# EasyEDA Pro project ProPrj_Line_Follower_TURBO_v1.2_2026-04-18.epro

# Schematic Schematic _Line_Follower_Turbo_v1.2
Board Name: Board1; Create Date: 2025-11-21; Page Name: P1; Project Name: High-Speed Line Follower Robot – Robotics_Wiz; Schematic Name: Schematic1; Update Date: 2025-11-21; Company: EasyEDA.com; Page Size: A4; Version: V1.0
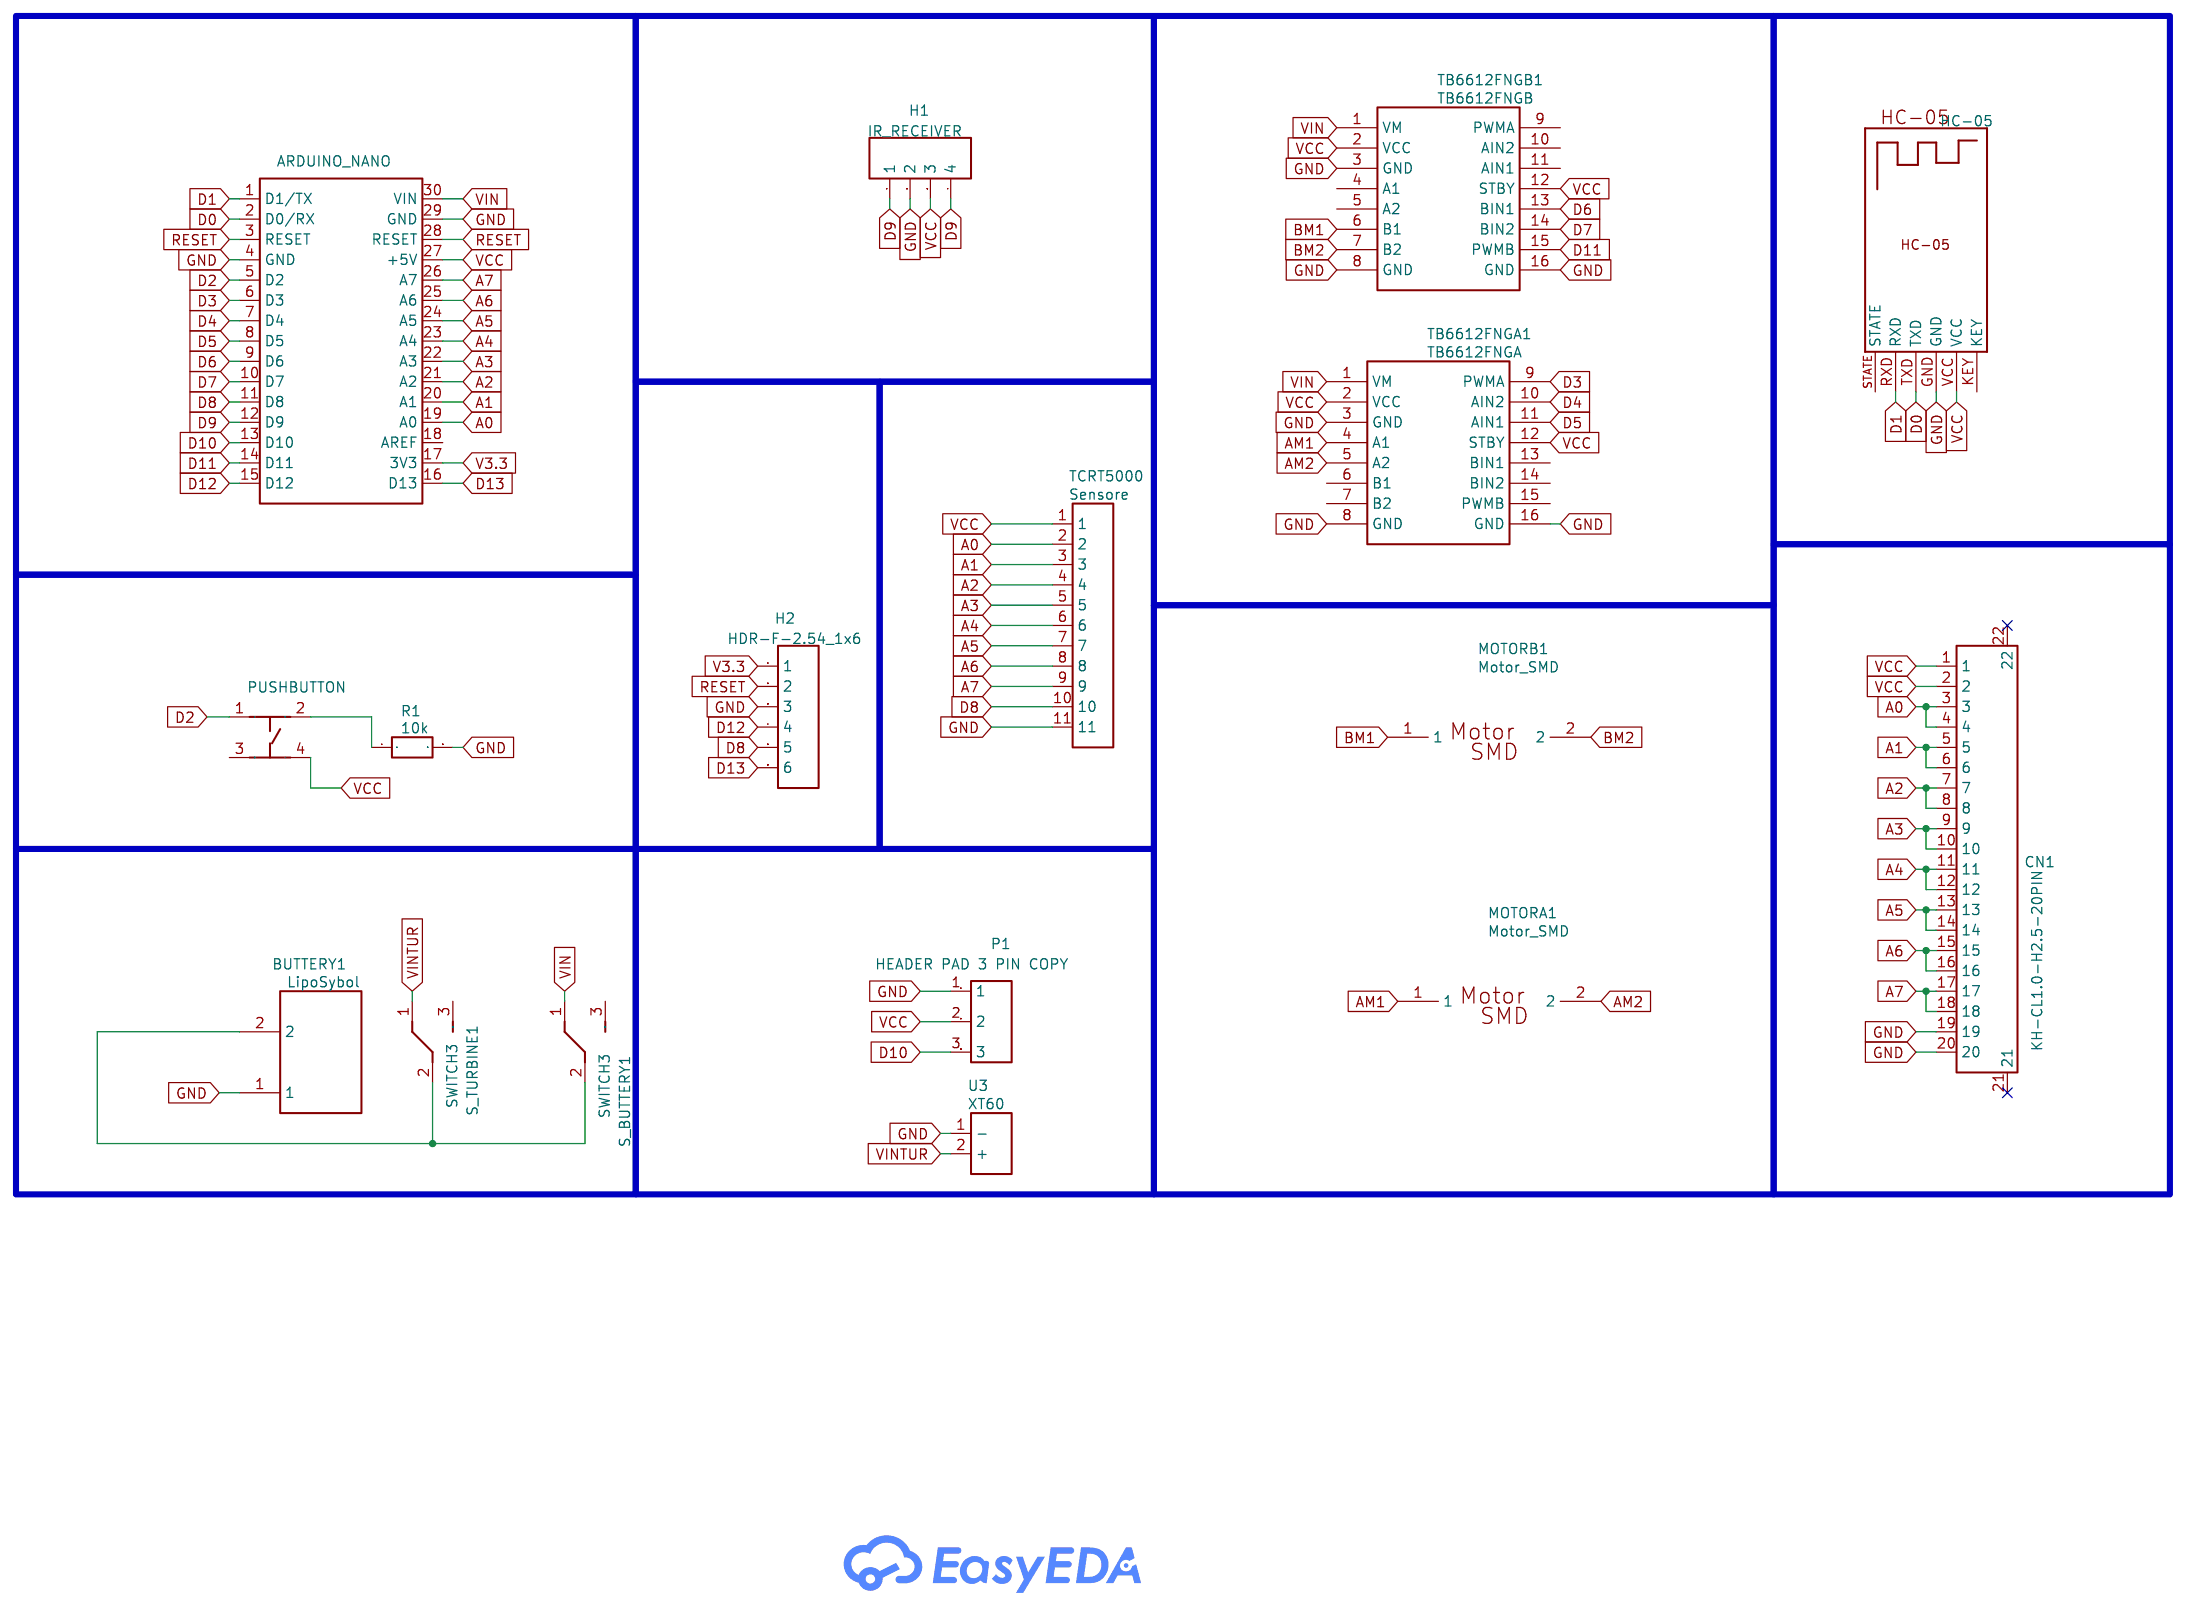
[diagram p0: schematic sheet]

## Parts
1  HC-05  [HC-05]
ARDUINO_NANO1  ARDUINO_NANO  [COMM-TH_ARDUINO_NANO]
BUTTERY1  LipoSybol  [2PIN-RMC]
CN1  KH-CL1.0-H2.5-20PIN  [FPC-SMD_KH-CL1.0-H2.5-20PIN]
D2  PUSHBUTTON  [SW-SMD_4P-L6.0-W6.0-P4.50-LS10.0_TL3301EF160QG]
H1  IR_RECEIVER  [HDR-F-2.54_1X4]
H2  HDR-F-2.54_1x6  [HDR-F-2.54_1X6]
MOTORA1  Motor_SMD  [MOTORSMD]
MOTORB1  Motor_SMD  [MOTORSMD]
P1  HEADER PAD 3 PIN COPY  [CONNECTOR_PINHEADER_2.54MM:PINHEADER_1X3]
R1  10k  [R0603]
S_BUTTERY1  SWITCH3  [SWITCH3PINS-DIP]
S_TURBINE1  SWITCH3  [SWITCH3PINS-DIP]
TB6612FNGA1  TB6612FNGA  [TB6612FNG]
TB6612FNGB1  TB6612FNGB  [TB6612FNG]
TCRT5000  Sensore
U3  XT60  [CONN-TH_XT60]

## Library data of the parts
1 = HC-05: Contributor: cingoz57; spicePre: ?
ARDUINO_NANO1 = ARDUINO_NANO: Supplier: LCSC; Supplier Part: C9900017879; Manufacturer: null; JLCPCB Part Class: Extended Part; link: https://lcsc.com/eda_search?q=C9900017879&%26type=1&ref=editor; Contributor: lcsc; spicePre: U
BUTTERY1 = LipoSybol: Contributor: tech1service; spicePre: U; spiceSymbolName: 2PIN RMC
CN1 = KH-CL1.0-H2.5-20PIN: Supplier: LCSC; Supplier Part: C2797243; Manufacturer: kinghelm(金航标); JLCPCB Part Class: Extended Part; Contributor: LCSC; spicePre: C
D2 = PUSHBUTTON: Supplier: LCSC; Supplier Part: C9900003768; Manufacturer: null; Manufacturer Part: 4pinTACTPCBTHTPushButton; JLCPCB Part Class: Extended Part; Contributor: LCSC; spicePre: K; spiceSymbolName: 4PINTACTPCBTHTPUSHBUTTON
H1 = IR_RECEIVER: Supplier Part: C225501; Supplier: LCSC; Contributor: LCEDA_Lib; spicePre: H; spiceSymbolName: HDR-F-2.54_1x4
H2 = HDR-F-2.54_1x6: Supplier Part: C40877; Supplier: LCSC; Contributor: LCEDA_Lib; spicePre: H
MOTORA1 MOTORB1 = Motor_SMD: Manufacturer Part: RayitoCorp; Supplier: RayitoCorp; Contributor: Josueking23; spicePre: U
P1 = HEADER PAD 3 PIN COPY: Supplier: LCSC; Manufacturer: BOOMELE; Manufacturer Part: Female headerHDR1X8-2.54; Supplier Part: C27438; JLCPCB Part Class: Extended Part; Contributor: juchani; spicePre: P; spiceSymbolName: HEADER PAD 3 PIN
R1 = 10k: nameAlias: Value(Ω); Contributor: LCEDA_Lib; spicePre: R; spiceSymbolName: R_0603_EU
S_BUTTERY1 S_TURBINE1 = SWITCH3: Contributor: TruongKhoa; spicePre: S
TB6612FNGA1 = TB6612FNGA: Contributor: NonpawitE; spicePre: U
TB6612FNGB1 = TB6612FNGB: Contributor: NonpawitE; spicePre: U
TCRT5000 = Sensore: Supplier: LCSC; Supplier Part: C9900004878; Manufacturer: null; Manufacturer Part: HDR-1X11; JLCPCB Part Class: Extended Part; link: https://lcsc.com/eda_search?q=C9900004878&%26type=1&ref=editor; Contributor: LCSC; spicePre: U; spiceSymbolName: HDR-1X11
U3 = XT60: Supplier: LCSC; Supplier Part: C98733; Manufacturer: AMASS(艾迈斯); Manufacturer Part: XT60-M.; JLCPCB Part Class: Extended Part; Contributor: lcsc; spicePre: U

## Nets
GND: 1.GND ARDUINO_NANO1.4(GND) ARDUINO_NANO1.29(GND) BUTTERY1.1 CN1.19 CN1.20 H1.2 H2.3 P1.1 R1.2 TB6612FNGA1.3(GND) TB6612FNGA1.8(GND) TB6612FNGA1.16(GND) TB6612FNGB1.3(GND) TB6612FNGB1.8(GND) TB6612FNGB1.16(GND) TCRT5000.11 U3.1(-)
V3.3: ARDUINO_NANO1.17(3V3) H2.1
VCC: 1.VCC ARDUINO_NANO1.27(+5V) CN1.1 CN1.2 D2.4 H1.3 P1.2 TB6612FNGA1.2(VCC) TB6612FNGA1.12(STBY) TB6612FNGB1.2(VCC) TB6612FNGB1.12(STBY) TCRT5000.1
VIN: ARDUINO_NANO1.30(VIN) S_BUTTERY1.1 TB6612FNGA1.1(VM) TB6612FNGB1.1(VM)
VINTUR: S_TURBINE1.1 U3.2(+)
A0: ARDUINO_NANO1.19(A0) CN1.3 CN1.4 TCRT5000.2
A1: ARDUINO_NANO1.20(A1) CN1.5 CN1.6 TCRT5000.3
A2: ARDUINO_NANO1.21(A2) CN1.7 CN1.8 TCRT5000.4
A3: ARDUINO_NANO1.22(A3) CN1.9 CN1.10 TCRT5000.5
A4: ARDUINO_NANO1.23(A4) CN1.11 CN1.12 TCRT5000.6
A5: ARDUINO_NANO1.24(A5) CN1.13 CN1.14 TCRT5000.7
A6: ARDUINO_NANO1.25(A6) CN1.15 CN1.16 TCRT5000.8
A7: ARDUINO_NANO1.26(A7) CN1.17 CN1.18 TCRT5000.9
AM1: MOTORA1.1 TB6612FNGA1.4(A1)
AM2: MOTORA1.2 TB6612FNGA1.5(A2)
BM1: MOTORB1.1 TB6612FNGB1.6(B1)
BM2: MOTORB1.2 TB6612FNGB1.7(B2)
D0: 1.TXD ARDUINO_NANO1.2(D0/RX)
D1: 1.RXD ARDUINO_NANO1.1(D1/TX)
D2: ARDUINO_NANO1.5(D2) D2.1
D3: ARDUINO_NANO1.6(D3) TB6612FNGA1.9(PWMA)
D4: ARDUINO_NANO1.7(D4) TB6612FNGA1.10(AIN2)
D5: ARDUINO_NANO1.8(D5) TB6612FNGA1.11(AIN1)
D6: ARDUINO_NANO1.9(D6) TB6612FNGB1.13(BIN1)
D7: ARDUINO_NANO1.10(D7) TB6612FNGB1.14(BIN2)
D8: ARDUINO_NANO1.11(D8) H2.5 TCRT5000.10
D9: ARDUINO_NANO1.12(D9) H1.1 H1.4
D10: ARDUINO_NANO1.13(D10) P1.3
D11: ARDUINO_NANO1.14(D11) TB6612FNGB1.15(PWMB)
D12: ARDUINO_NANO1.15(D12) H2.4
D13: ARDUINO_NANO1.16(D13) H2.6
RESET: ARDUINO_NANO1.3(RESET) ARDUINO_NANO1.28(RESET) H2.2
BUTTERY1_2: BUTTERY1.2 S_BUTTERY1.2 S_TURBINE1.2
R1_1: D2.2 R1.1

Not connected (* = marked no-connect by the designer): 1 KEY STATE; ARDUINO_NANO1 18(AREF); CN1 21* 22*; D2 3; S_BUTTERY1 3(I/O2); S_TURBINE1 3(I/O2); TB6612FNGA1 6(B1) 7(B2) 13(BIN1) 14(BIN2) 15(PWMB); TB6612FNGB1 4(A1) 5(A2) 9(PWMA) 10(AIN2) 11(AIN1)

# Board PCB_Line_Follower_Turbo_v1.2
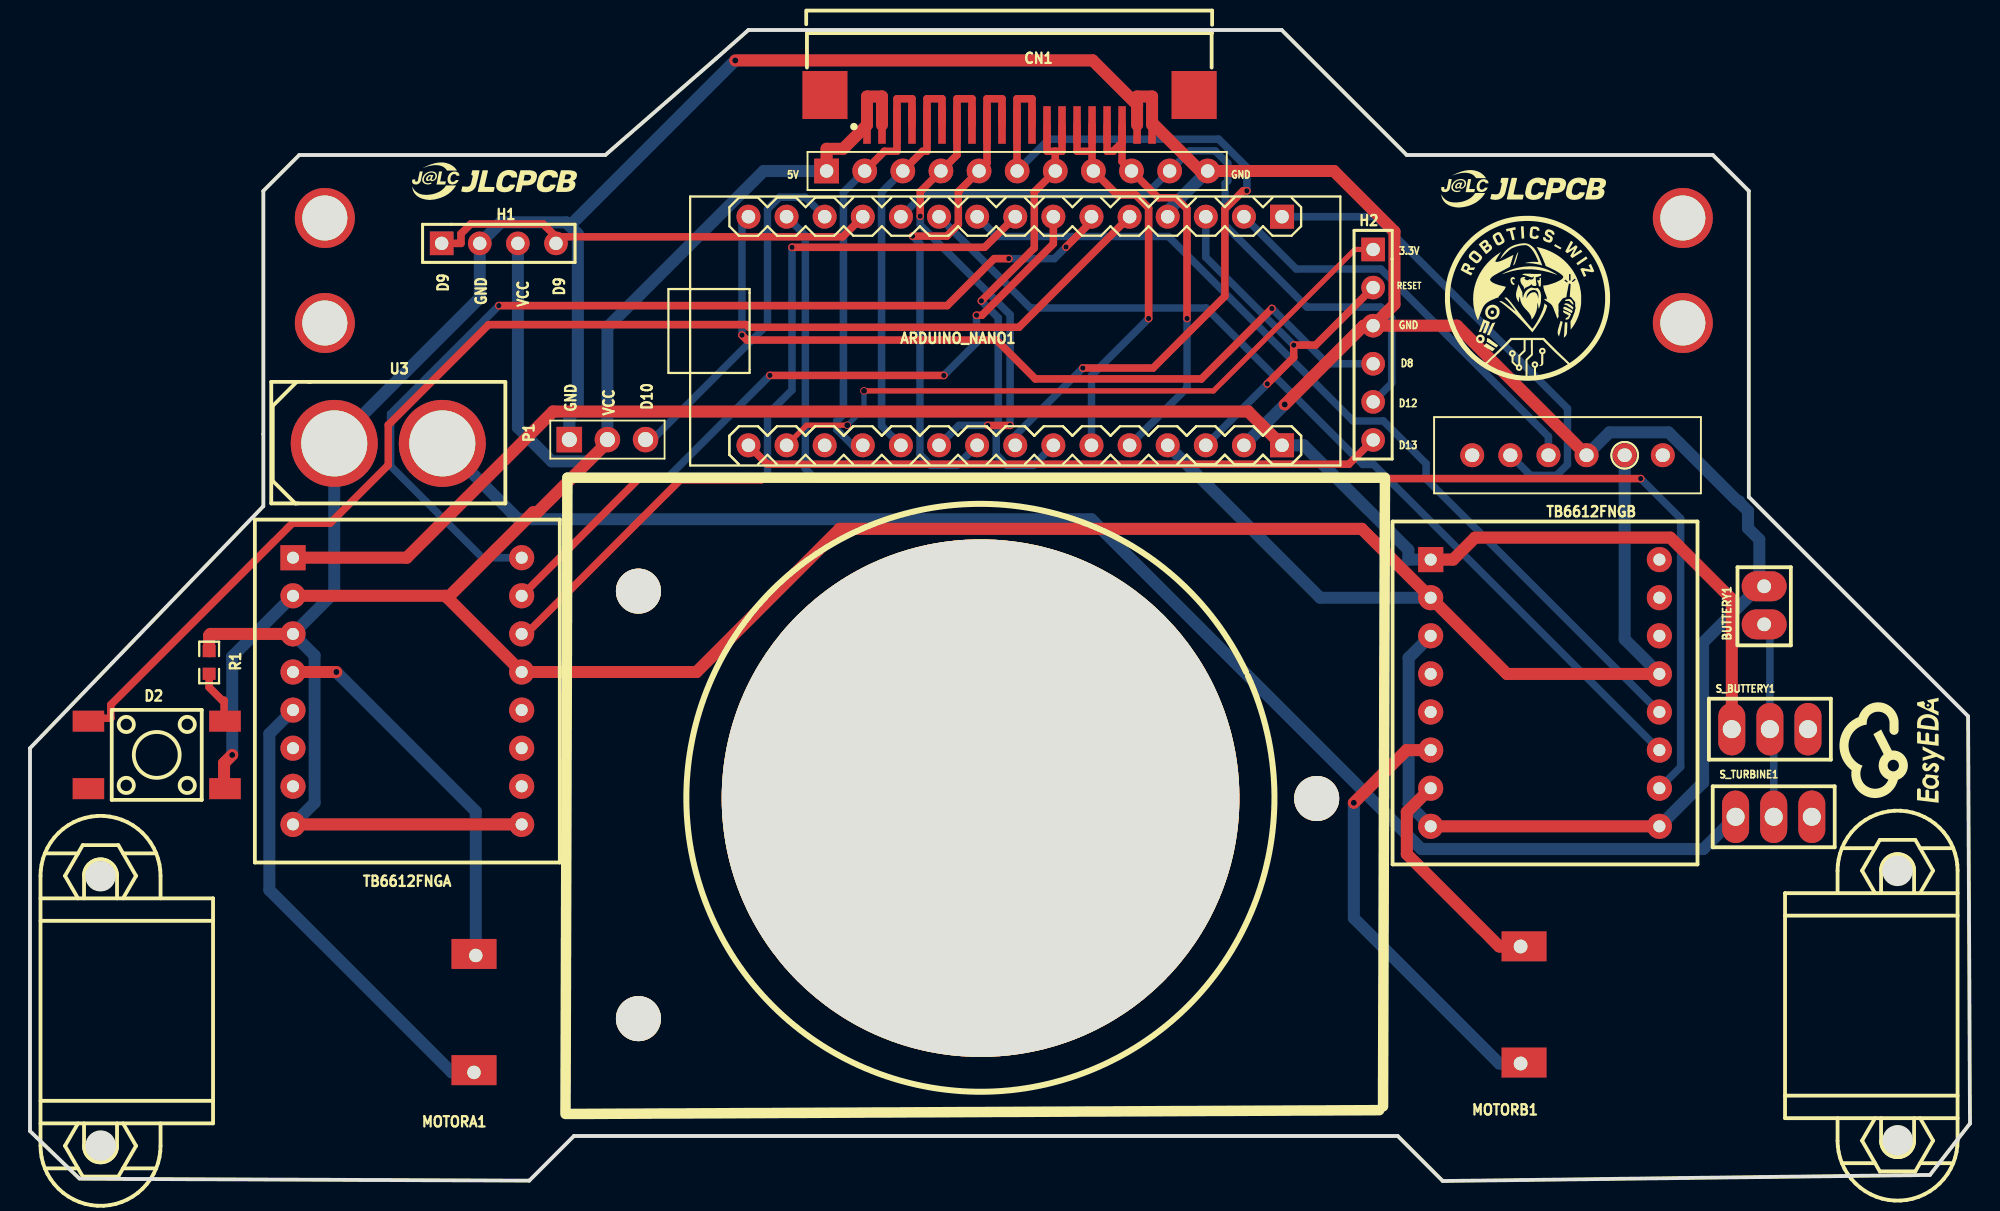
[diagram p1: board, top side]
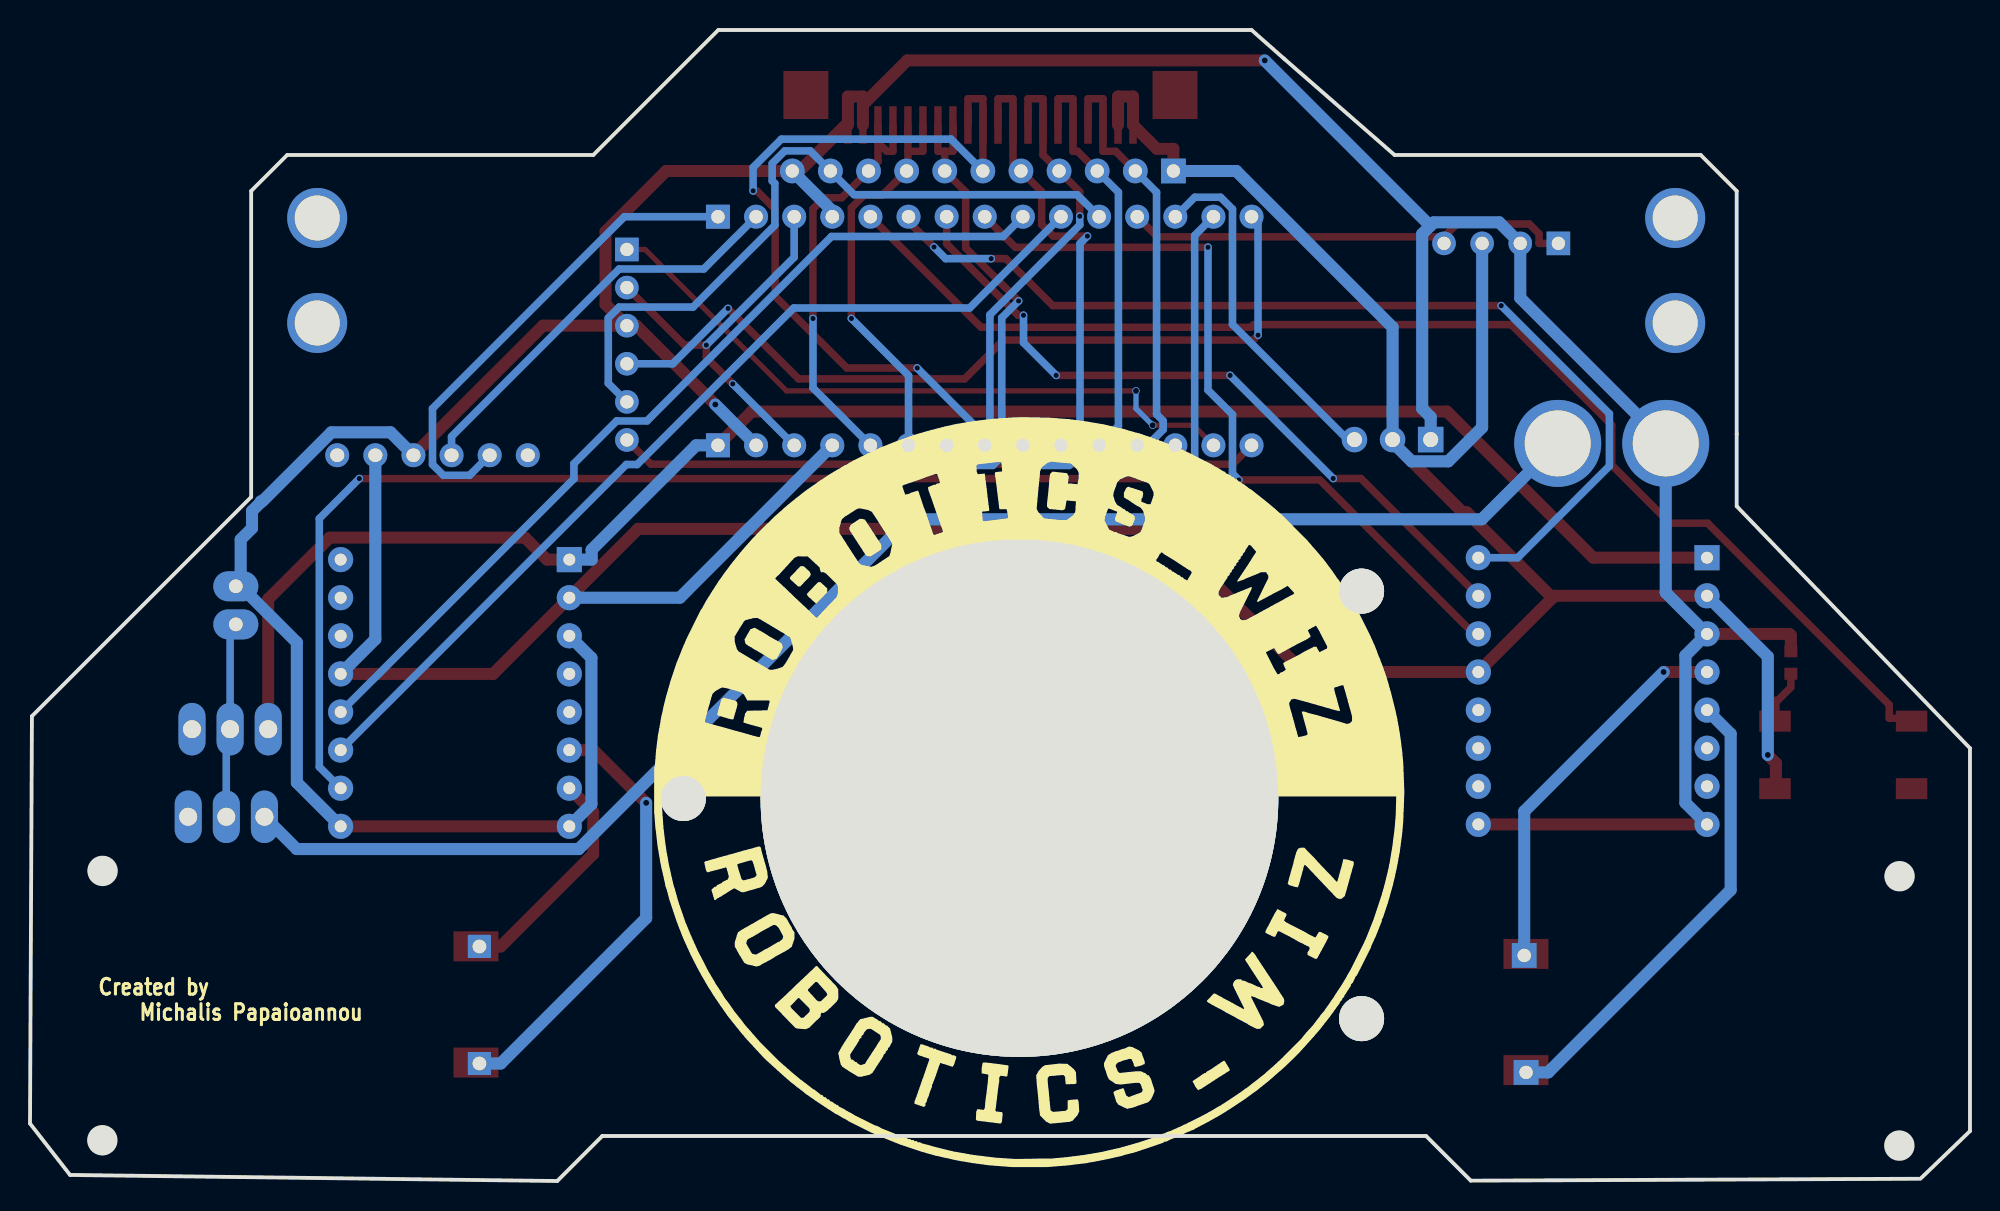
[diagram p2: board, bottom side, seen from below]

Outline 129.29 x 76.73 mm; copper layers: Top Layer, Bottom Layer. Coordinates in mm from the lower left corner of the outline.
Outline path: 3.3,0.15 0,3.32 0,28.85 15.55,44.99 15.55,66 17.95,68.4 38.35,68.4 45.72,74.83 47.88,76.73 83.41,76.73 91.75,68.4 112.15,68.4 114.55,66 114.55,45.6 129.16,30.99 129.29,3.83 126.62,0.4 94.15,0 91.15,3 36.25,3 33.27,0.02 3.43,0.15
Stack: Top Layer 0.035mm / Dielectric1 1.51mm FR4 er 4.5 / Bottom Layer 0.035mm

## Design rules (mm)
template: JLCPCB Capability(Two Layers Board)
spacing copperThickness1oz (default): track to track 0.102, other pairs 0.152 to 0.3
spacing copperThickness2oz: track to track 0.203, other pairs 0.152 to 0.3
track width copperThickness1oz (default): min 0.127, default 0.254, max 2.54
track width copperThickness2oz: min 0.203, default 0.254, max 2.54
differential pair differentialPair (default): width min 0.127, default 0.254, max 2.54; gap min 0.152, default 0.152
via viaSize (default): diameter min 0.5, default 0.61, max 10; hole min 0.3, default 0.305, max 6.3

## Placement (name value [footprint] x y rotation side)
1  -  [HC-05]  98.65 38.22 0 top
ARDUINO_NANO1  ARDUINO_NANO  [COMM-TH_ARDUINO_NANO]  65.66 56.66 0 top
BUTTERY1  LipoSybol  [2PIN-RMC]  115.57 38.38 0 top
CN1  KH-CL1.0-H2.5-20PIN  [FPC-SMD_KH-CL1.0-H2.5-20PIN]  65.28 71.4 180 top
D2  PUSHBUTTON  [SW-SMD_4P-L6.0-W6.0-P4.50-LS10.0_TL3301EF160QG]  8.45 28.41 0 top
H1  IR_RECEIVER  [HDR-F-2.54_1X4]  31.24 62.51 0 top
H2  HDR-F-2.54_1x6  [HDR-F-2.54_1X6]  89.51 57.02 270 top
MOTORA1  Motor_SMD  [MOTORSMD]  13.72 11.2 0 top
MOTORB1  Motor_SMD  [MOTORSMD]  115.44 11.83 180 top
NOREF  -  [Pad_e14064]  85.75 25.5 0 top
NOREF#2  -  [Pad_e14061]  40.55 10.82 0 top
NOREF#3  -  [Pad_e14060]  29.71 15.03 90 top
NOREF#4  -  [Pad_e14062]  40.55 39.32 0 top
NOREF#5  -  [Pad_e14059]  29.59 7.24 90 top
NOREF#6  -  [Pad_e14063]  63.35 25.52 0 top
NOREF#7  -  [Pad_e14068]  110.15 64.2 0 top
NOREF#8  -  [Pad_e14067]  110.15 57.2 0 top
NOREF#9  -  [Pad_e14065]  99.34 15.63 90 top
NOREF#10  -  [Pad_e14057]  19.65 64.2 0 top
NOREF#11  -  [Pad_e14066]  99.34 7.83 90 top
NOREF#12  -  [Pad_e14058]  19.65 57.2 0 top
P1  HEADER PAD 3 PIN COPY  [CONNECTOR_PINHEADER_2.54MM:PINHEADER_1X3]  35.94 49.43 90 top
R1  10k  [R0603]  11.94 34.57 90 top
S_BUTTERY1  SWITCH3  [SWITCH3PINS-DIP]  113.41 30.12 0 top
S_TURBINE1  SWITCH3  [SWITCH3PINS-DIP]  113.66 24.28 0 top
TB6612FNGA  TB6612FNGA  [TB6612FNG]  25.15 33.93 0 top
TB6612FNGB  TB6612FNGB  [TB6612FNG]  100.97 33.8 0 top
TCRT5000  Sensore  [11P QTR8A]  65.79 67.33 90 top
U3  XT60  [CONN-TH_XT60]  23.88 49.17 0 top

## Footprints (pads in the part's own frame, mm; a bottom-side part is the same pattern mirrored in y, then rotated)
2PIN-RMC
  oval 3x2 hole 0.914: 1(0,1.27) 2(0,-1.27)
11P QTR8A
  rect 1.651x1.651 hole 0.894x0.889: 1(0,12.7)
  round 1.651 hole 0.894x0.889: 2(0,10.16) 3(0,7.62) 4(0,5.08) 5(0,2.54) 6(0,0) 7(0,-2.54) 8(0,-5.08) 9(0,-7.62) 10(0,-10.16) 11(0,-12.7)
COMM-TH_ARDUINO_NANO
  rect 1.6x1.6 hole 0.9: 1(17.78,7.62) 30(17.78,-7.62)
  round 1.6 hole 0.9: 2(15.24,7.62) 3(12.7,7.62) 4(10.16,7.62) 5(7.62,7.62) 6(5.08,7.62) 7(2.54,7.62) 8(0,7.62) 9(-2.54,7.62) 10(-5.08,7.62) 11(-7.62,7.62) 12(-10.16,7.62) 13(-12.7,7.62) 14(-15.24,7.62) 15(-17.78,7.62) 16(-17.78,-7.62) 17(-15.24,-7.62) 18(-12.7,-7.62) 19(-10.16,-7.62) 20(-7.62,-7.62) 21(-5.08,-7.62) 22(-2.54,-7.62) 23(0,-7.62) 24(2.54,-7.62) 25(5.08,-7.62) 26(7.62,-7.62) 27(10.16,-7.62) 28(12.7,-7.62) 29(15.24,-7.62)
CONN-TH_XT60
  round 5.8 hole 4.4: 1(-3.6,0) 2(3.6,0)
CONNECTOR_PINHEADER_2.54MM:PINHEADER_1X3
  rect 1.7x1.7 hole 1.005x1: 1(0,0)
  round 1.7 hole 1.005x1: 2(0,-2.54) 3(0,-5.08)
FPC-SMD_KH-CL1.0-H2.5-20PIN
  rect 0.5x2.5 smd: 1(9.5,1) 2(8.5,1) 3(7.5,1) 4(6.5,1) 5(5.5,1) 6(4.5,1) 7(3.5,1) 8(2.5,1) 9(1.5,1) 10(0.5,1) 11(-0.5,1) 12(-1.5,1) 13(-2.5,1) 14(-3.5,1) 15(-4.5,1) 16(-5.5,1) 17(-6.5,1) 18(-7.5,1) 19(-8.5,1) 20(-9.5,1)
  rect 3x3.2 smd: 21(-12.3,-1) 22(12.3,-1)
HC-05
  round 1.6 hole 0.945x0.9: GND(5.08,10.16) KEY(10.16,10.16) RXD(0,10.16) STATE(-2.54,10.16) TXD(2.54,10.16) VCC(7.62,10.16)
HDR-F-2.54_1X4
  rect 1.575x1.575 hole 0.889: 1(-3.81,0)
  round 1.575 hole 0.889: 2(-1.27,0) 3(1.27,0) 4(3.81,0)
HDR-F-2.54_1X6
  rect 1.575x1.575 hole 0.889: 1(-5.08,0)
  round 1.575 hole 0.889: 2(-2.54,0) 3(0,0) 4(2.54,0) 5(5.08,0) 6(7.62,0)
MOTORSMD
  rect 3x2 smd: 1(15.875,3.937) 2(15.875,-3.81)
Pad_e14057
  round 4 hole 3: 13(0,0)
Pad_e14058
  round 4 hole 3: 13(0,0)
Pad_e14059
  rect 1.651x1.651 hole 0.894x0.889: 5(0,0)
Pad_e14060
  rect 1.651x1.651 hole 0.894x0.889: 4(0,0)
Pad_e14061
  round 3 hole 3: 13(0,0)
Pad_e14062
  round 3 hole 3: 13(0,0)
Pad_e14063
  oval 34.5x34.5 hole 34.5: 1(0,0)
Pad_e14064
  round 3 hole 3: 13(0,0)
Pad_e14065
  rect 1.542x1.542 hole 0.914: 6(0,0)
Pad_e14066
  rect 1.542x1.542 hole 0.914: 7(0,0)
Pad_e14067
  round 4 hole 3: 13(0,0)
Pad_e14068
  round 4 hole 3: 13(0,0)
R0603
  rect 0.806x0.864 smd: 1(-0.753,0) 2(0.753,0)
SW-SMD_4P-L6.0-W6.0-P4.50-LS10.0_TL3301EF160QG
  rect 2.1x1.4 smd: 1(-4.55,2.25) 2(4.55,2.25) 3(-4.55,-2.25) 4(4.55,-2.25)
SWITCH3PINS-DIP
  oval 1.8x3.5 hole 1.2x1.2: 1(0,0) 2(2.54,0) 3(5.08,0)
TB6612FNG
  rect 1.676x1.676 hole 0.8: 1(-7.62,7.62)
  round 1.676 hole 0.8: 2(-7.62,5.08) 3(-7.62,2.54) 4(-7.62,0) 5(-7.62,-2.54) 6(-7.62,-5.08) 7(-7.62,-7.62) 8(-7.62,-10.16) 9(7.62,7.62) 10(7.62,5.08) 11(7.62,2.54) 12(7.62,0) 13(7.62,-2.54) 14(7.62,-5.08) 15(7.62,-7.62) 16(7.62,-10.16)

## Nets
GND: 1.GND ARDUINO_NANO1.4 ARDUINO_NANO1.29 BUTTERY1.1 CN1.19 CN1.20 H1.2 H2.3 P1.1 R1.2 TB6612FNGA.3 TB6612FNGA.8 TB6612FNGA.16 TB6612FNGB.3 TB6612FNGB.8 TB6612FNGB.16 TCRT5000.11 U3.1
V3.3: ARDUINO_NANO1.17 H2.1
VCC: 1.VCC ARDUINO_NANO1.27 CN1.1 CN1.2 D2.4 H1.3 P1.2 TB6612FNGA.2 TB6612FNGA.12 TB6612FNGB.2 TB6612FNGB.12 TCRT5000.1
VIN: ARDUINO_NANO1.30 S_BUTTERY1.1 TB6612FNGA.1 TB6612FNGB.1
VINTUR: S_TURBINE1.1 U3.2
1_KEY: 1.KEY
1_STATE: 1.STATE
A0: ARDUINO_NANO1.19 CN1.3 CN1.4 TCRT5000.2
A1: ARDUINO_NANO1.20 CN1.5 CN1.6 TCRT5000.3
A2: ARDUINO_NANO1.21 CN1.7 CN1.8 TCRT5000.4
A3: ARDUINO_NANO1.22 CN1.9 CN1.10 TCRT5000.5
A4: ARDUINO_NANO1.23 CN1.11 CN1.12 TCRT5000.6
A5: ARDUINO_NANO1.24 CN1.13 CN1.14 TCRT5000.7
A6: ARDUINO_NANO1.25 CN1.15 CN1.16 TCRT5000.8
A7: ARDUINO_NANO1.26 CN1.17 CN1.18 TCRT5000.9
AM1: MOTORA1.1 NOREF#3.4 TB6612FNGA.4
AM2: MOTORA1.2 NOREF#5.5 TB6612FNGA.5
ARDUINO_NANO1_18: ARDUINO_NANO1.18
BM1: MOTORB1.1 NOREF#11.7 TB6612FNGB.6
BM2: MOTORB1.2 NOREF#9.6 TB6612FNGB.7
BUTTERY1_2: BUTTERY1.2 S_BUTTERY1.2 S_TURBINE1.2
D0: 1.TXD ARDUINO_NANO1.2
D1: 1.RXD ARDUINO_NANO1.1
D2: ARDUINO_NANO1.5 D2.1
D2_3: D2.3
D3: ARDUINO_NANO1.6 TB6612FNGA.9
D4: ARDUINO_NANO1.7 TB6612FNGA.10
D5: ARDUINO_NANO1.8 TB6612FNGA.11
D6: ARDUINO_NANO1.9 TB6612FNGB.13
D7: ARDUINO_NANO1.10 TB6612FNGB.14
D8: ARDUINO_NANO1.11 H2.5 TCRT5000.10
D9: ARDUINO_NANO1.12 H1.1 H1.4
D10: ARDUINO_NANO1.13 P1.3
D11: ARDUINO_NANO1.14 TB6612FNGB.15
D12: ARDUINO_NANO1.15 H2.4
D13: ARDUINO_NANO1.16 H2.6
R1_1: D2.2 R1.1
RESET: ARDUINO_NANO1.3 ARDUINO_NANO1.28 H2.2
S_BUTTERY1_3: S_BUTTERY1.3
S_TURBINE1_3: S_TURBINE1.3
TB1_3: NOREF#6.1
TB6612FNGA_6: TB6612FNGA.6
TB6612FNGA_7: TB6612FNGA.7
TB6612FNGA_13: TB6612FNGA.13
TB6612FNGA_14: TB6612FNGA.14
TB6612FNGA_15: TB6612FNGA.15
TB6612FNGB_4: TB6612FNGB.4
TB6612FNGB_5: TB6612FNGB.5
TB6612FNGB_9: TB6612FNGB.9
TB6612FNGB_10: TB6612FNGB.10
TB6612FNGB_11: TB6612FNGB.11

Pads without a net: CN1 21 22; NOREF 13; NOREF#2 13; NOREF#4 13; NOREF#7 13; NOREF#8 13; NOREF#10 13; NOREF#12 13

## Via types
v1: diameter 0.7, hole 0.4, Top Layer to Bottom Layer, 5 vias
v2: diameter 0.5, hole 0.35, Top Layer to Bottom Layer, 24 vias
v3: diameter 0.5, hole 0.4, Top Layer to Bottom Layer, 2 vias

## Routing (per net, layer and track width the routed paths; a pad name or vN(x,y) marks a point on that pad's centre or on a via; arc(x,y) is an arc through that point)
GND: length 263.7
  Top Layer w0.8: 32.77,23.77 17.53,23.77 ; 74.78,70.55 74.78,72.3 73.78,72.3 73.78,71.75 ; 74.78,70.55 77.99,67.33 TCRT5000.11 86.89,67.33 90.93,63.29 90.93,58.44 H2.3 ; 74.78,70.55 CN1.20 ; v1(83.62,51.77) 88.87,57.02 H2.3 ; H2.3 95.1,57.02 1.GND ; 73.78,71.75 70.82,74.7 v1(47,74.7) ; 73.78,71.75 CN1.19 ; R1.2 11.94,36.37 12.04,36.47 17.53,36.47 ; TB6612FNGB.16 TB6612FNGB.8
  Bottom Layer w0.8: 115.25,39.65 115.25,42.76 114.49,43.52 114.49,44.66 113.96,45.2 113.9,45.32 ; 115.25,39.65 111.5,35.9 111.5,26.56 TB6612FNGB.16 ; 115.25,39.65 BUTTERY1.1 ; ARDUINO_NANO1.29 v1(83.62,51.77) ; 1.GND 105.26,49.91 109.2,49.91 113.79,45.32 ; P1.1 35.94,50.93 36.51,51.49 36.51,63.14 35.97,63.67 ; TCRT5000.11 75.82,64.67 ARDUINO_NANO1.4 ; 35.97,63.67 v1(47,74.7) ; 35.97,63.67 35.73,63.91 31.37,63.91 H1.2 29.97,58.87 U3.1 20.28,39.22 17.53,36.47 18.97,35.03 18.97,25.21 17.53,23.77 ; TB6612FNGB.8 91.87,25.12 91.87,34.87 TB6612FNGB.3
V3.3: length 45.2
  Top Layer w0.35: v3(55.58,52.67) 78.87,52.67 88.3,62.1 H2.1 ; v3(54.47,50.38) 51.76,50.38 ARDUINO_NANO1.17
  Bottom Layer w0.35: v3(54.47,50.38) 55.58,51.49 v3(55.58,52.67)
VCC: length 224
  Top Layer w0.8: CN1.2 56.78,72.3 55.78,72.3 CN1.1 54.19,68.81 53.09,68.81 TCRT5000.1 ; TB6612FNGA.2 27.69,39.01 27.83,38.87 ; 12.93,26.35 12.93,27.86 v1(13.47,28.4) ; P1.2 38.48,49.24 33.81,44.58 33.53,44.58 27.83,38.87 ; 27.83,38.87 TB6612FNGA.12 44.42,33.93 53.96,43.48 88.75,43.48 TB6612FNGB.2 98.43,33.8 TB6612FNGB.12
  Bottom Layer w0.8: 1.VCC 106.27,36.12 TB6612FNGB.12 ; TCRT5000.1 48.9,67.33 38.48,56.92 P1.2 38.48,49.24 37.21,47.97 34.77,47.97 32.51,50.23 H1.3 ; TB6612FNGB.2 85.98,38.88 ARDUINO_NANO1.27 ; v1(13.47,28.4) 13.47,34.96 TB6612FNGA.2
VIN: length 115.4
  Top Layer w0.8: ARDUINO_NANO1.30 81.19,51.3 34.85,51.3 25.11,41.55 17.53,41.55 ; TB6612FNGB.1 94.83,41.42 96.3,42.89 109.31,42.89 113.41,38.79 S_BUTTERY1.1
  Bottom Layer w0.8: TB6612FNGB.1 91.86,41.42 91.86,42.08 84.89,49.05 ARDUINO_NANO1.30
VINTUR: length 98.3
  Bottom Layer w0.8: S_TURBINE1.1 111.51,22.13 92.72,22.13 70.73,44.12 32.53,44.12 U3.2
A0: length 29.1
  Top Layer w0.5: CN1.4 58.78,72.15 57.78,72.15 CN1.3 57.78,68.65 56.94,68.65 TCRT5000.2
  Bottom Layer w0.5: ARDUINO_NANO1.19 54.82,49.05 53.77,50.09 53.77,50.67 54.21,51.12 54.21,65.92 TCRT5000.2
A1: length 27.8
  Top Layer w0.5: CN1.6 60.78,72.15 59.78,72.15 CN1.5 59.78,68.65 59.48,68.65 TCRT5000.3
  Bottom Layer w0.5: TCRT5000.3 56.75,65.92 56.75,50.33 ARDUINO_NANO1.20
A2: length 33.3
  Top Layer w0.5: v2(65.32,50.37) v2(63.83,50.37) ; v2(59.33,64.32) 59.33,65.95 TCRT5000.4 61.78,68.41 CN1.7 61.78,72.15 62.78,72.15 CN1.8
  Bottom Layer w0.5: v2(65.32,50.37) 65.32,57.75 59.33,63.74 v2(59.33,64.32) ; v2(63.83,50.37) 61.91,50.37 ARDUINO_NANO1.21
A3: length 34.7
  Top Layer w0.5: v2(58.82,62.99) 61.09,62.99 61.87,63.76 61.87,65.95 TCRT5000.5 63.78,67.86 CN1.9 63.78,72.15 64.78,72.15 CN1.10
  Bottom Layer w0.5: v2(58.82,62.99) 59.31,62.5 59.31,48.43 60.04,47.7 61.78,47.7 ARDUINO_NANO1.22
A4: length 52.3
  Top Layer w0.5: v2(81.09,66.01) 80.85,66.01 79.63,64.79 79.63,58.98 74.85,54.2 v2(70.16,54.2) ; CN1.12 66.78,72.15 65.78,72.15 CN1.11 65.78,67.34 TCRT5000.6
  Bottom Layer w0.5: v2(70.16,54.2) 65.66,49.7 ARDUINO_NANO1.23 ; TCRT5000.6 67.91,69.45 79.21,69.45 81.09,67.57 v2(81.09,66.01)
A5: length 31.9
  Top Layer w0.5: 63.4,58.67 66.93,62.2 66.93,65.94 TCRT5000.7 68.33,68.65 ; 68.33,68.65 67.78,68.65 CN1.13 ; 68.33,68.65 68.78,68.65 CN1.14
  Bottom Layer w0.5: ARDUINO_NANO1.24 66.86,47.7 65.12,47.7 64.39,48.43 64.39,49.84 64.53,49.98 64.53,57.54 v2(63.4,58.67)
A6: length 28
  Top Layer w0.5: 70.78,68.65 69.78,68.65 CN1.15 ; 70.78,68.65 70.78,67.42 TCRT5000.8 72.47,65.73 73.69,65.73 74.55,64.87 v2(74.55,57.5) ; 70.78,68.65 CN1.16
  Bottom Layer w0.5: v2(74.55,57.5) 70.74,53.69 ARDUINO_NANO1.25
A7: length 28.4
  Top Layer w0.5: 72.78,69.24 72.78,67.96 TCRT5000.9 75.19,65.55 76.36,65.55 77.11,64.8 v2(77.11,57.5) ; 72.78,69.24 CN1.18 ; 72.78,69.24 72.19,68.65 71.78,68.65 CN1.17
  Bottom Layer w0.5: v2(77.11,57.5) 77.11,52.87 ARDUINO_NANO1.26
AM1: length 25.8
  Top Layer w0.8: TB6612FNGA.4 v1(20.42,33.93) ; MOTORA1.1 29.61,15.14 NOREF#3.4
  Bottom Layer w0.8: v1(20.42,33.93) 29.71,24.64 NOREF#3.4
AM2: length 31.5
  Top Layer w0.8: NOREF#5.5 29.59,7.38 MOTORA1.2
  Bottom Layer w0.8: NOREF#5.5 28.11,7.24 15.95,19.4 15.95,29.81 TB6612FNGA.5
BM1: length 29.6
  Top Layer w0.8: NOREF#11.7 99.4,7.9 MOTORB1.1 ; TB6612FNGB.6 91.74,28.72 v1(88.22,25.21)
  Bottom Layer w0.8: NOREF#11.7 97.91,7.83 88.22,17.53 v1(88.22,25.21)
BM2: length 15.4
  Top Layer w0.8: TB6612FNGB.7 91.75,24.59 91.75,21.79 97.91,15.63 NOREF#9.6 99.35,15.64 MOTORB1.2
BUTTERY1_2: length 13.1
  Bottom Layer w0.5: S_TURBINE1.2 116.21,29.87 S_BUTTERY1.2 115.95,36.73 BUTTERY1.2
D0: length 27.6
  Bottom Layer w0.5: 1.TXD 101.19,49.63 90.02,60.8 84.39,60.8 ARDUINO_NANO1.2
D1: length 32.7
  Bottom Layer w0.5: 1.RXD 99.99,47.04 101.74,47.04 102.46,47.77 102.46,51.5 89.67,64.28 ARDUINO_NANO1.1
D2: length 85.5
  Top Layer w0.5: ARDUINO_NANO1.5 65.91,56.91 47.91,56.91 47.74,57.09 30.57,57.09 23.88,50.4 23.88,47.73 20,43.85 17.49,43.85 5.38,31.75 5.38,30.85 3.83,30.85
D3: length 67.1
  Top Layer w0.5: v2(69.04,62.26) 70.74,63.96 ARDUINO_NANO1.6 ; v2(31.24,58.36) 61.12,58.36 64.26,61.49 v2(65.23,61.49)
  Bottom Layer w0.5: v2(69.04,62.26) 68.27,61.49 v2(65.23,61.49) ; 32.77,41.55 30.14,41.55 24.03,47.66 24.03,51.14 v2(31.24,58.36)
D4: length 48
  Top Layer w0.5: TB6612FNGA.10 40.59,46.83 v2(42.44,46.83) ; v2(63.08,57.71) 63.44,57.71 68.2,62.48 ARDUINO_NANO1.7 ; v2(60.9,53.71) v2(49.31,53.71)
  Bottom Layer w0.5: v2(60.9,53.71) 63.08,55.88 v2(63.08,57.71) ; v2(42.44,46.83) v2(49.31,53.71)
D5: length 52.3
  Top Layer w0.5: v2(48.73,46.74) 43.33,46.74 33.07,36.47 32.77,36.47 ; ARDUINO_NANO1.8 63.62,62.24 v2(50.78,62.24)
  Bottom Layer w0.5: v2(50.78,62.24) 50.78,52.73 49.15,51.09 49.15,47.16 v2(48.73,46.74)
D6: length 59.7
  Bottom Layer w0.5: ARDUINO_NANO1.9 64.44,62.97 75.87,62.97 88.17,50.67 90.19,50.67 93.04,47.82 93.04,46.81 TB6612FNGB.13
D7: length 62.7
  Bottom Layer w0.5: ARDUINO_NANO1.10 66.66,58.2 78.39,58.2 88.82,47.77 89.55,47.77 TB6612FNGB.14
D8: length 47.9
  Bottom Layer w0.5: H2.5 90.75,53.18 90.75,57.53 90.02,58.26 85.1,58.26 79.65,63.71 79.65,66.5 79.82,66.68 79.82,67.83 78.98,68.67 77.29,68.67 TCRT5000.10 74.36,65.75 59.51,65.75 ARDUINO_NANO1.11
D9: length 30.3
  Top Layer w0.5: 35.05,62.95 54.16,62.95 ARDUINO_NANO1.12 ; 35.05,62.95 H1.4 ; 35.05,62.95 34.2,63.8 29.36,63.8 28.72,63.15 28.72,62.51 H1.1
D10: length 23.7
  Bottom Layer w0.5: ARDUINO_NANO1.13 51.66,65.58 49.94,65.58 49.15,64.79 49.15,57.1 41.48,49.43 P1.3
D11: length 95.6
  Top Layer w0.5: v2(107.34,46.83) v2(52.32,46.83)
  Bottom Layer w0.5: v2(107.34,46.83) 110,44.16 110,27.6 TB6612FNGB.15 ; ARDUINO_NANO1.14 51.67,63.03 51.67,47.48 v2(52.32,46.83)
D12: length 54.8
  Top Layer w0.5: v2(82.77,58.17) 78.07,53.47 67,53.47 64.41,56.06 47.78,56.06 v2(47.45,56.39)
  Bottom Layer w0.5: v2(47.45,56.39) 47.45,63.85 ARDUINO_NANO1.15 ; H2.4 86.45,54.48 v2(82.77,58.17)
D13: length 42.8
  Top Layer w0.5: H2.6 87.89,47.79 49.14,47.79 ARDUINO_NANO1.16
R1_1: length 3.5
  Top Layer w0.5: R1.1 11.94,32.91 12.8,32.05 12.93,32.05 12.93,30.85
RESET: length 27
  Top Layer w0.5: v2(82.46,53.14) 84.22,54.9 v2(84.22,55.72) 85.67,55.72 H2.2
  Bottom Layer w0.5: ARDUINO_NANO1.3 78.36,61.58 v2(84.22,55.72) ; ARDUINO_NANO1.28 v2(82.46,53.14)

## Text on the board
Bottom Silkscreen Layer: Created by / Michalis Papaioannou
Top Silkscreen Layer: RESET | 5V | GND | 3.3V | D12 | D13 | D8 | D9 | VCC | D10
